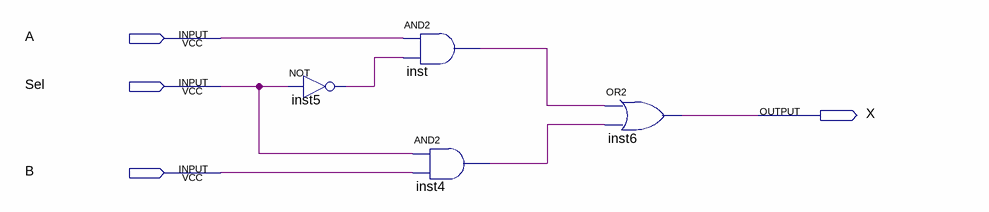
[diagram p0: schematic sheet]
// Quartus schematic wb_block_2-1mux.bdf as structural Verilog: 4 symbols, 4 pins
module \wb_block_2-1mux  (
  input  A,
  input  Sel,
  input  B,
  output X
);

  wire inst4_out, inst5_out, inst_out;

  not inst5 (inst5_out, Sel);
  and inst (inst_out, A, inst5_out);
  and inst4 (inst4_out, Sel, B);
  or inst6 (X, inst_out, inst4_out);
endmodule
